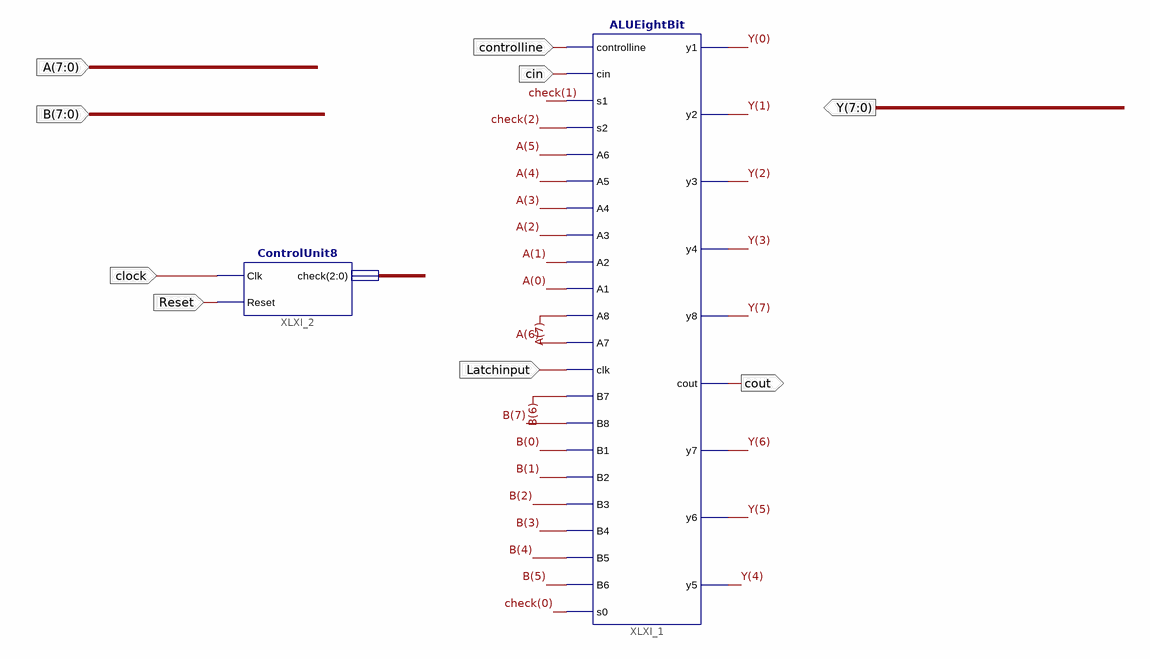
[diagram p0: schematic sheet 1]
// Xilinx ISE schematic OPERATION8.sch (spartan3a) as structural Verilog: 2 symbols, 9 ports
module OPERATION8 (
  input  [7:0] B,
  input  [7:0] A,
  input  Latchinput,
  input  Reset,
  input  clock,
  input  controlline,
  input  cin,
  output [7:0] Y,
  output cout
);

  wire [2:0] check;

  ALUEightBit XLXI_1 (
    .controlline(controlline), .cin(cin), .s1(check[1]), .s2(check[2]), .A6(A[5]), .A5(A[4]), .A4(A[3]),
    .A3(A[2]), .A2(A[1]), .A1(A[0]), .A8(A[7]), .A7(A[6]), .clk(Latchinput), .B7(B[6]), .B8(B[7]), .B1(B[0]),
    .B2(B[1]), .B3(B[2]), .B4(B[3]), .B5(B[4]), .B6(B[5]), .s0(check[0]), .y1(Y[0]), .y2(Y[1]), .y3(Y[2]),
    .y4(Y[3]), .y8(Y[7]), .cout(cout), .y7(Y[6]), .y6(Y[5]), .y5(Y[4]));
  ControlUnit8 XLXI_2 (.Clk(clock), .Reset(Reset), .check(check));
endmodule
